# Altium schematic sheet MCU.SchDoc
size A4
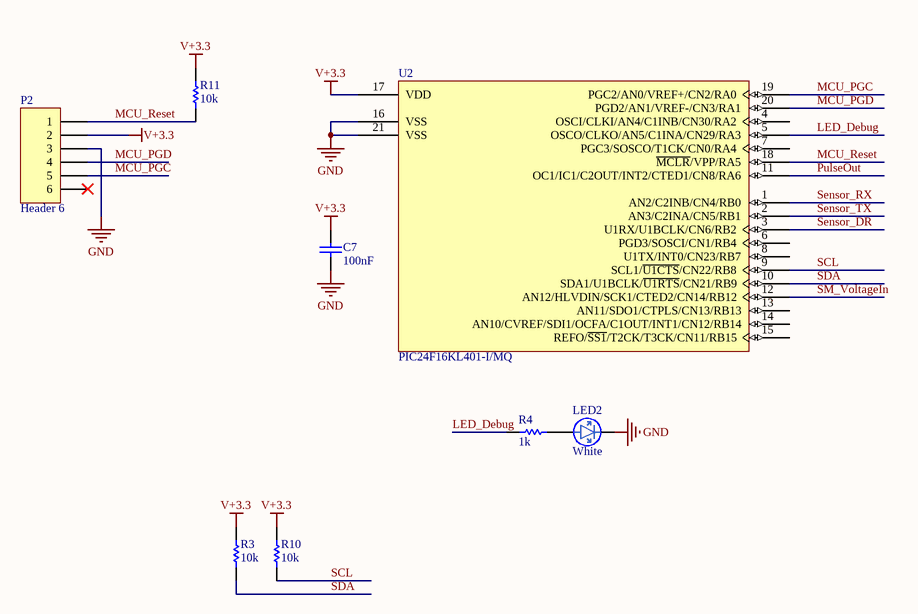
[diagram p0: MCU.SchDoc]

## Parts
C7  100nF  [0603]
LED2  White  [LED-0603-RED]
P2  Header 6  [MHDR1X6]
R3  10k  [0603]
R4  1k  [0603]
R10  10k  [0603]
R11  10k  [0603]
U2  PIC24F16KL401-I/MQ  [QFN-MQ20_N]

## Nets
GND: C7.2 LED2.K P2.3 U2.16(VSS) U2.21(VSS)
V+3.3: C7.1 P2.2 R3.2 R10.2 R11.2 U2.17(VDD)
LED_Debug: R4.1 U2.5(OSCO/CLKO/AN5/C1INA/CN29/RA3)
MCU_PGC: P2.5 U2.19(PGC2/AN0/VREF+/CN2/RA0)
MCU_PGD: P2.4 U2.20(PGD2/AN1/VREF-/CN3/RA1)
MCU_Reset: P2.1 R11.1 U2.18(~{MCLR}/VPP/RA5)
PulseOut: U2.11(OC1/IC1/C2OUT/INT2/CTED1/CN8/RA6)
SCL: R10.1 U2.9(SCL1/~{U1CTS}/CN22/RB8)
SDA: R3.1 U2.10(SDA1/U1BCLK/~{U1RTS}/CN21/RB9)
Sensor_DR: U2.3(U1RX/U1BCLK/CN6/RB2)
Sensor_RX: U2.1(AN2/C2INB/CN4/RB0)
Sensor_TX: U2.2(AN3/C2INA/CN5/RB1)
SM_VoltageIn: U2.12(AN12/HLVDIN/SCK1/CTED2/CN14/RB12)
NetLED2_A: LED2.A R4.2

Not connected (* = marked no-connect by the designer): P2 6*; U2 4(OSCI/CLKI/AN4/C1INB/CN30/RA2) 6(PGD3/SOSCI/CN1/RB4) 7(PGC3/SOSCO/T1CK/CN0/RA4) 8(U1TX/INT0/CN23/RB7) 13(AN11/SDO1/CTPLS/CN13/RB13) 14(AN10/CVREF/SDI1/OCFA/C1OUT/INT1/CN12/RB14) 15(REFO/~{SS1}/T2CK/T3CK/CN11/RB15)

## Library data of the parts
C7 = Cap Semi: Capacitor (Semiconductor SIM Model); Published: 8-Jun-2000; LatestRevisionDate: 29-May-2009; LatestRevisionNote: IPC-7351 Footprint Added.; PackageReference: C1206; Publisher: Altium Limited; PackageDescription: Chip Capacitor; Value: 100nF
LED2 = SMD_LED_0805
P2 = Header 6: Header, 6-Pin; LatestRevisionDate: 17-Jul-2002; LatestRevisionNote: Re-released for DXP Platform.; Publisher: Altium Limited
R3 R10 R11 = Res1: Resistor; Value: 1K; Published: 8-Jun-2000; LatestRevisionDate: 17-Jul-2002; LatestRevisionNote: Re-released for DXP Platform.; PackageReference: AXIAL-0.3; Publisher: Altium Limited
R4 = Res1: Resistor; Published: 8-Jun-2000; LatestRevisionDate: 17-Jul-2002; LatestRevisionNote: Re-released for DXP Platform.; PackageReference: AXIAL-0.3; Publisher: Altium Limited; Value: 1K
U2 = PIC24F04KA201T-I/MQ: General Purpose 16-Bit Flash Microcontroller with nanoWatt XLP Technology, 4KB Flash, 512 bytes SRAM, 20-Pin QFN, Industrial Temperature, Tape and Reel; FirstPublished: 2-Dec-2009; DatasheetVersion: revB, May-2009; PackageVersion: revBB, Aug-2009; PackageReference: QFN-MQ20; Publisher: Altium Limited; PackageDescription: 20-Lead Plastic Quad Flat, No Lead Package (MQ) - 5x5x0.9 mm Body [QFN]; Supplier 1: Digi-Key; Supplier Part Number 1: PIC24F04KA201T-I/MQ-ND; Supplier 2: Newark; Supplier Part Number 2: 08R2010; ComponentLink1Description: Datasheet; ComponentLink1URL: http://ww1.microchip.com/downloads/en/DeviceDoc/39937b.pdf; ComponentLink2Description: Packaging Specification; ComponentLink2URL: http://www.microchip.com/stellent/groups/techpub_sg/documents/packagingspec/en012702.pdf; ComponentLink3Description: Microchip.com Home; ComponentLink3URL: http://www.microchip.com/